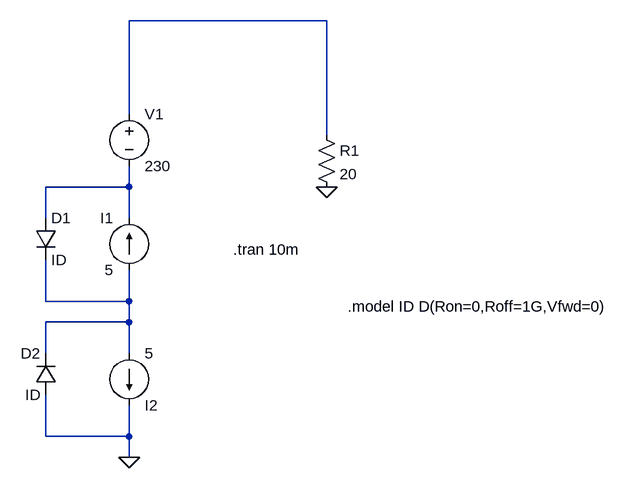
[diagram p0: schematic Draft1.asc]
Draft1.asc, the LTspice schematic file:
Version 4
SHEET 1 908 680
WIRE 432 -96 128 -96
WIRE 128 48 128 -96
WIRE 432 80 432 -96
WIRE 128 160 128 128
WIRE 128 160 0 160
WIRE 0 208 0 160
WIRE 128 208 128 160
WIRE 0 336 0 272
WIRE 128 336 128 288
WIRE 128 336 0 336
WIRE 128 368 128 336
WIRE 128 368 0 368
WIRE 0 416 0 368
WIRE 128 416 128 368
WIRE 0 544 0 480
WIRE 128 544 128 496
WIRE 128 544 0 544
WIRE 128 576 128 544
FLAG 432 160 0
FLAG 128 576 0
SYMBOL current 128 288 R180
WINDOW 0 24 80 Left 2
WINDOW 3 24 0 Left 2
WINDOW 123 0 0 Left 0
WINDOW 39 0 0 Left 0
SYMATTR InstName I1
SYMATTR Value 5
SYMBOL voltage 128 32 R0
WINDOW 123 0 0 Left 0
WINDOW 39 0 0 Left 0
SYMATTR InstName V1
SYMATTR Value 230
SYMBOL diode -16 208 R0
SYMATTR InstName D1
SYMATTR Value ID
SYMBOL res 416 64 R0
SYMATTR InstName R1
SYMATTR Value 20
SYMBOL current 128 416 R0
WINDOW 0 24 80 Left 2
WINDOW 3 24 0 Left 2
WINDOW 123 0 0 Left 0
WINDOW 39 0 0 Left 0
SYMATTR InstName I2
SYMATTR Value 5
SYMBOL diode 16 480 R180
WINDOW 0 24 64 Left 2
WINDOW 3 24 0 Left 2
SYMATTR InstName D2
SYMATTR Value ID
TEXT 288 256 Left 2 !.tran 10m
TEXT 464 344 Left 2 !.model ID D(Ron=0,Roff=1G,Vfwd=0)

The netlist it stands for:
* Draft1.asc
I1 N003 N002 5
V1 N001 N002 230
D1 N002 N003 ID
R1 N001 0 20
I2 N003 0 5
D2 0 N003 ID
.model D D
.lib standard.dio
.tran 10m
.model ID D(Ron=0,Roff=1G,Vfwd=0)
.backanno
.end